# Altium schematic sheet POWER_TESTER_V2.SchDoc
size 660 x 513 mm
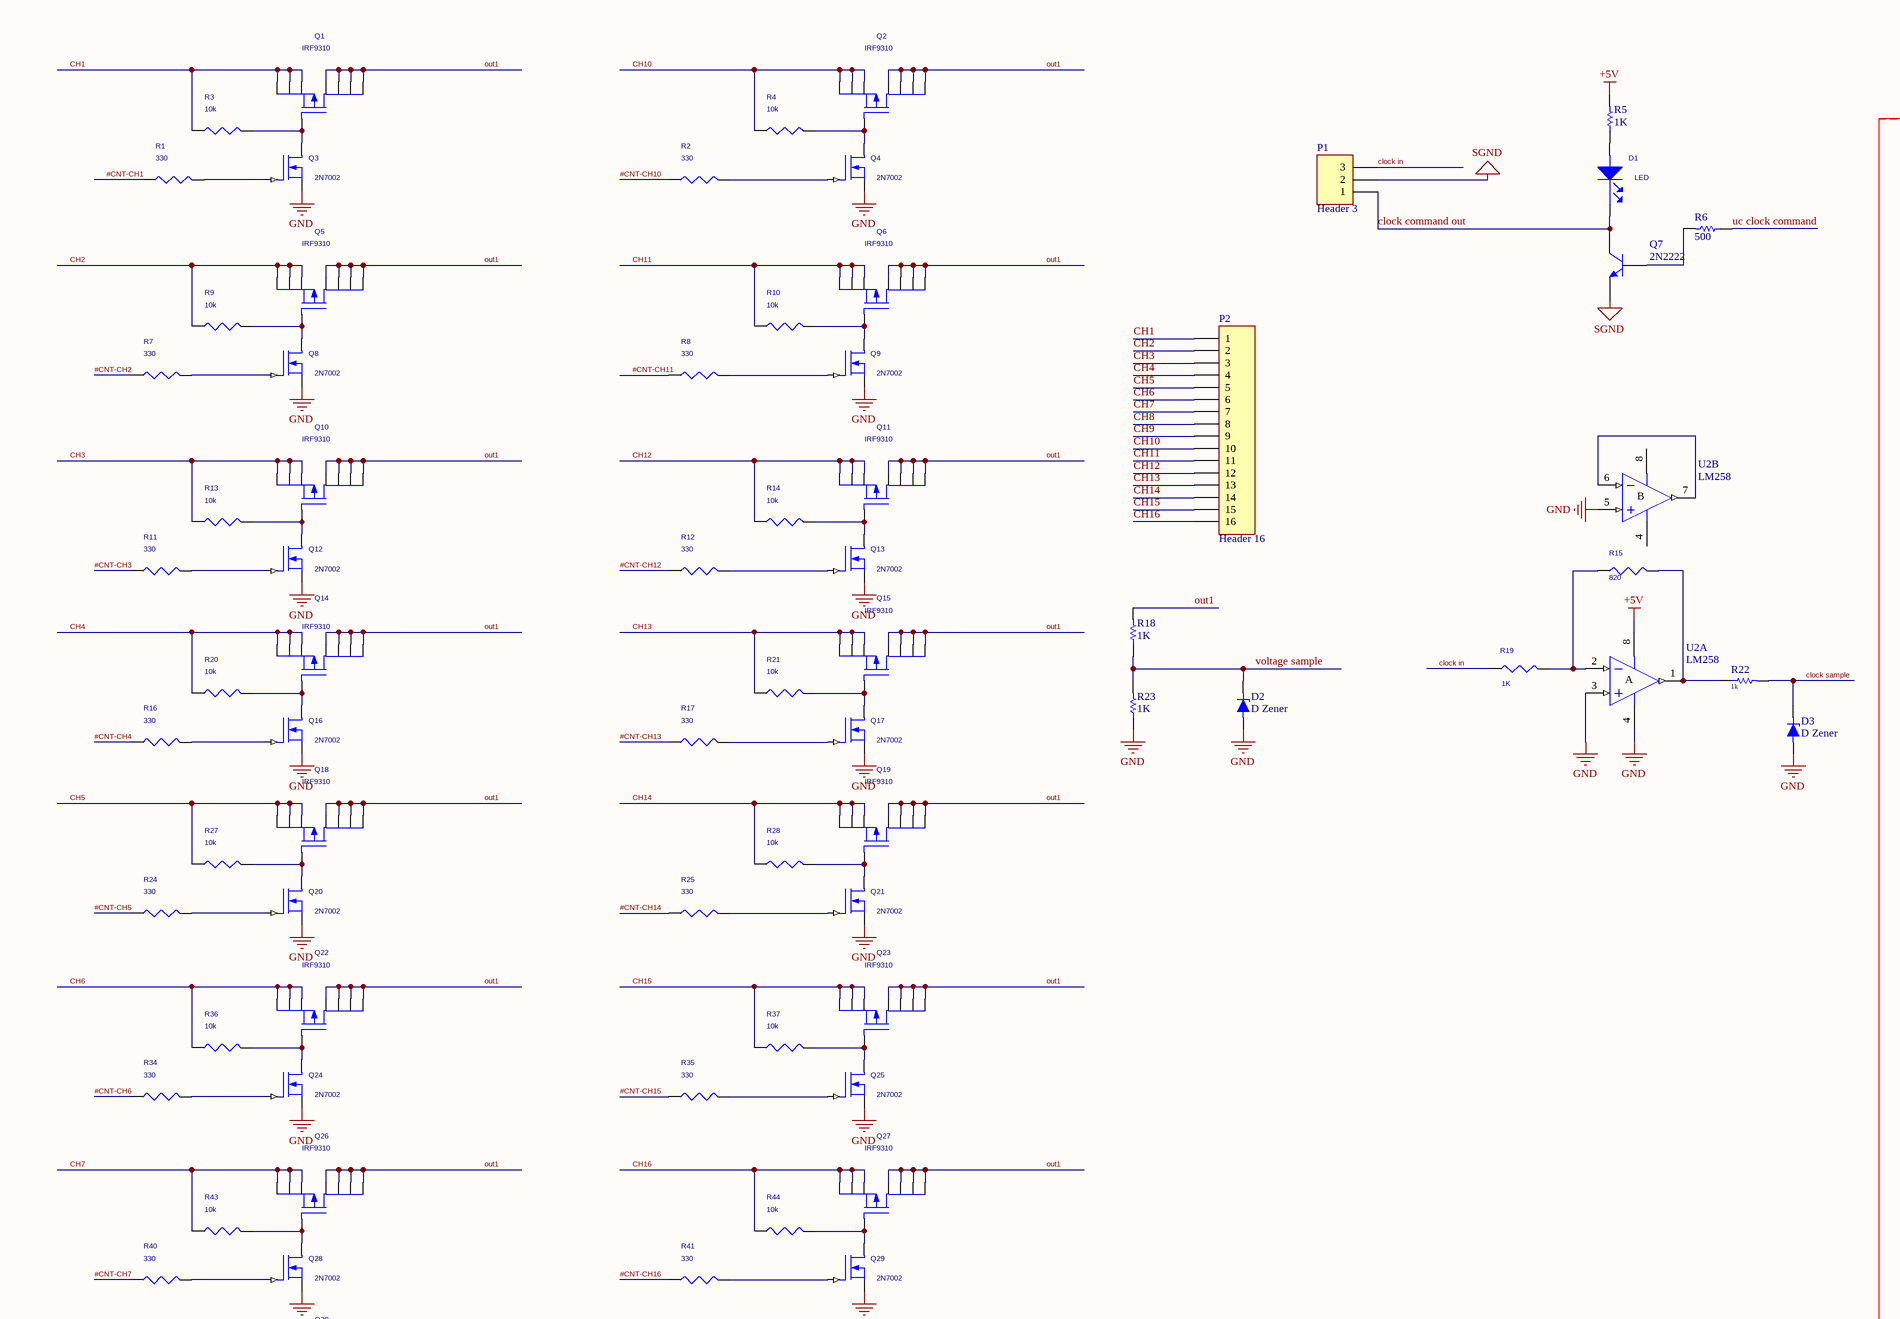
[diagram p0: POWER_TESTER_V2.SchDoc, top left]
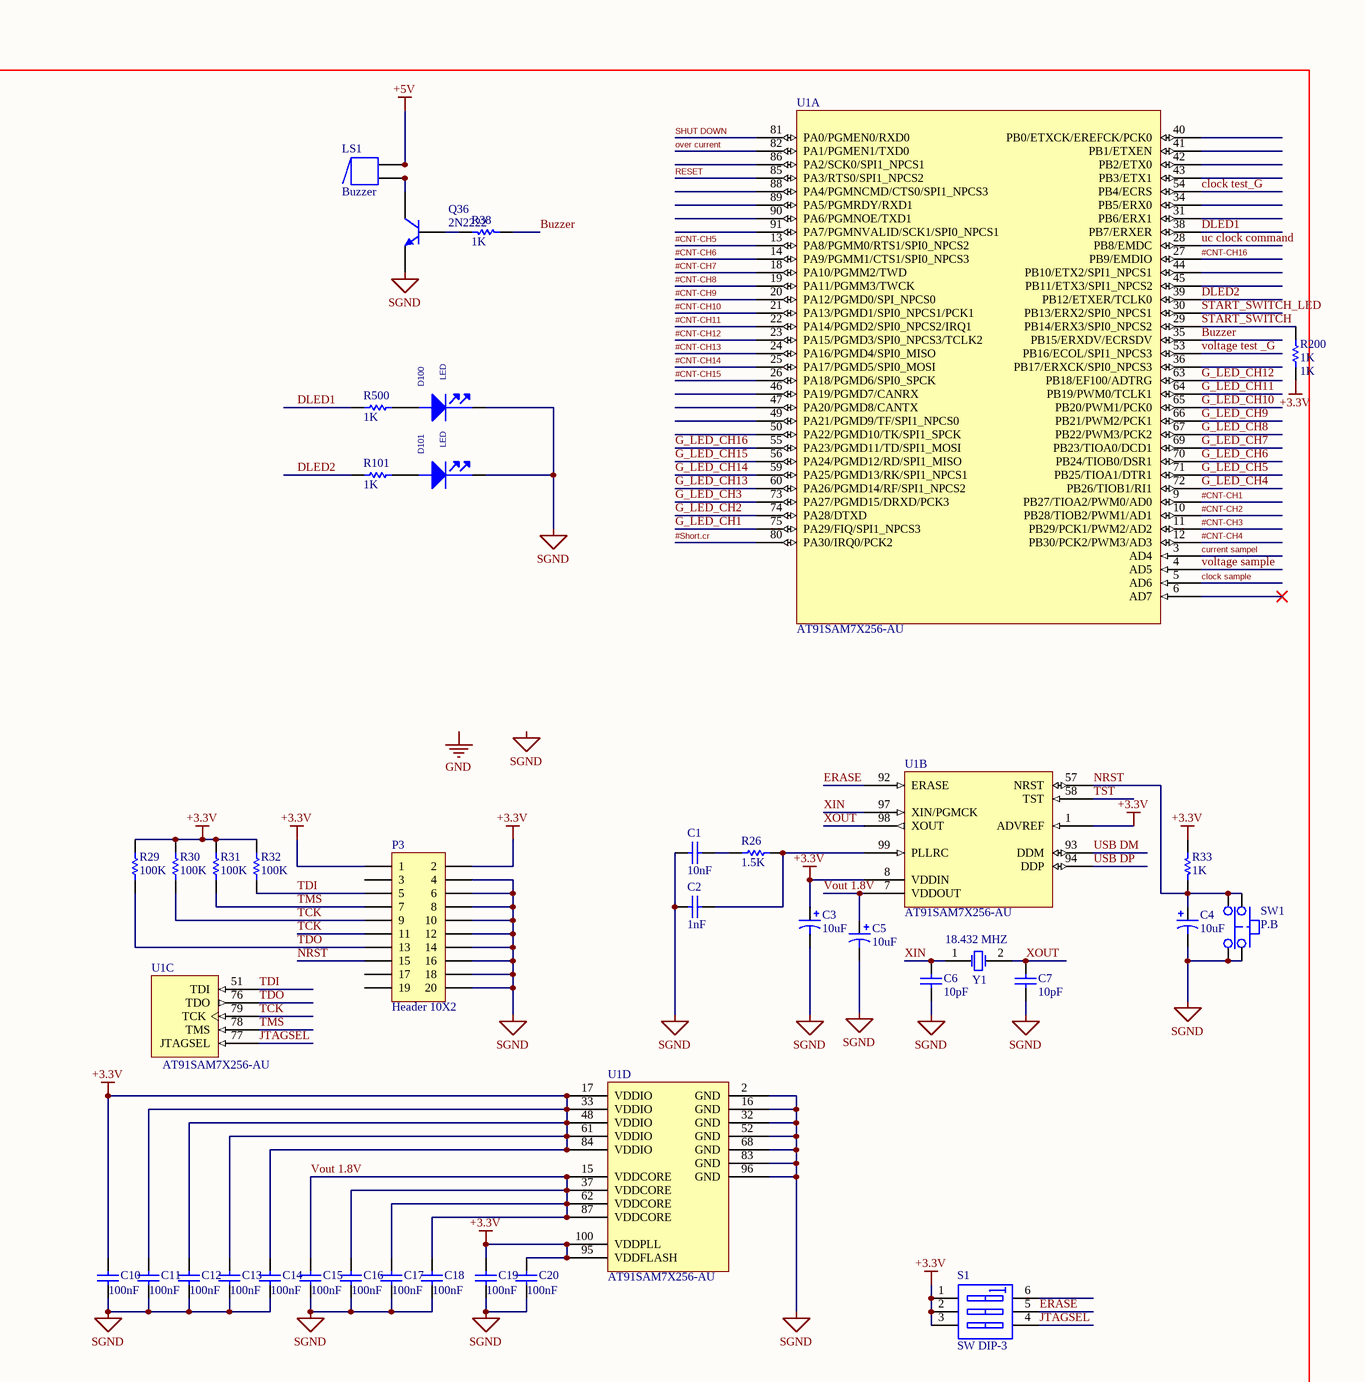
[diagram p1: POWER_TESTER_V2.SchDoc, top right]
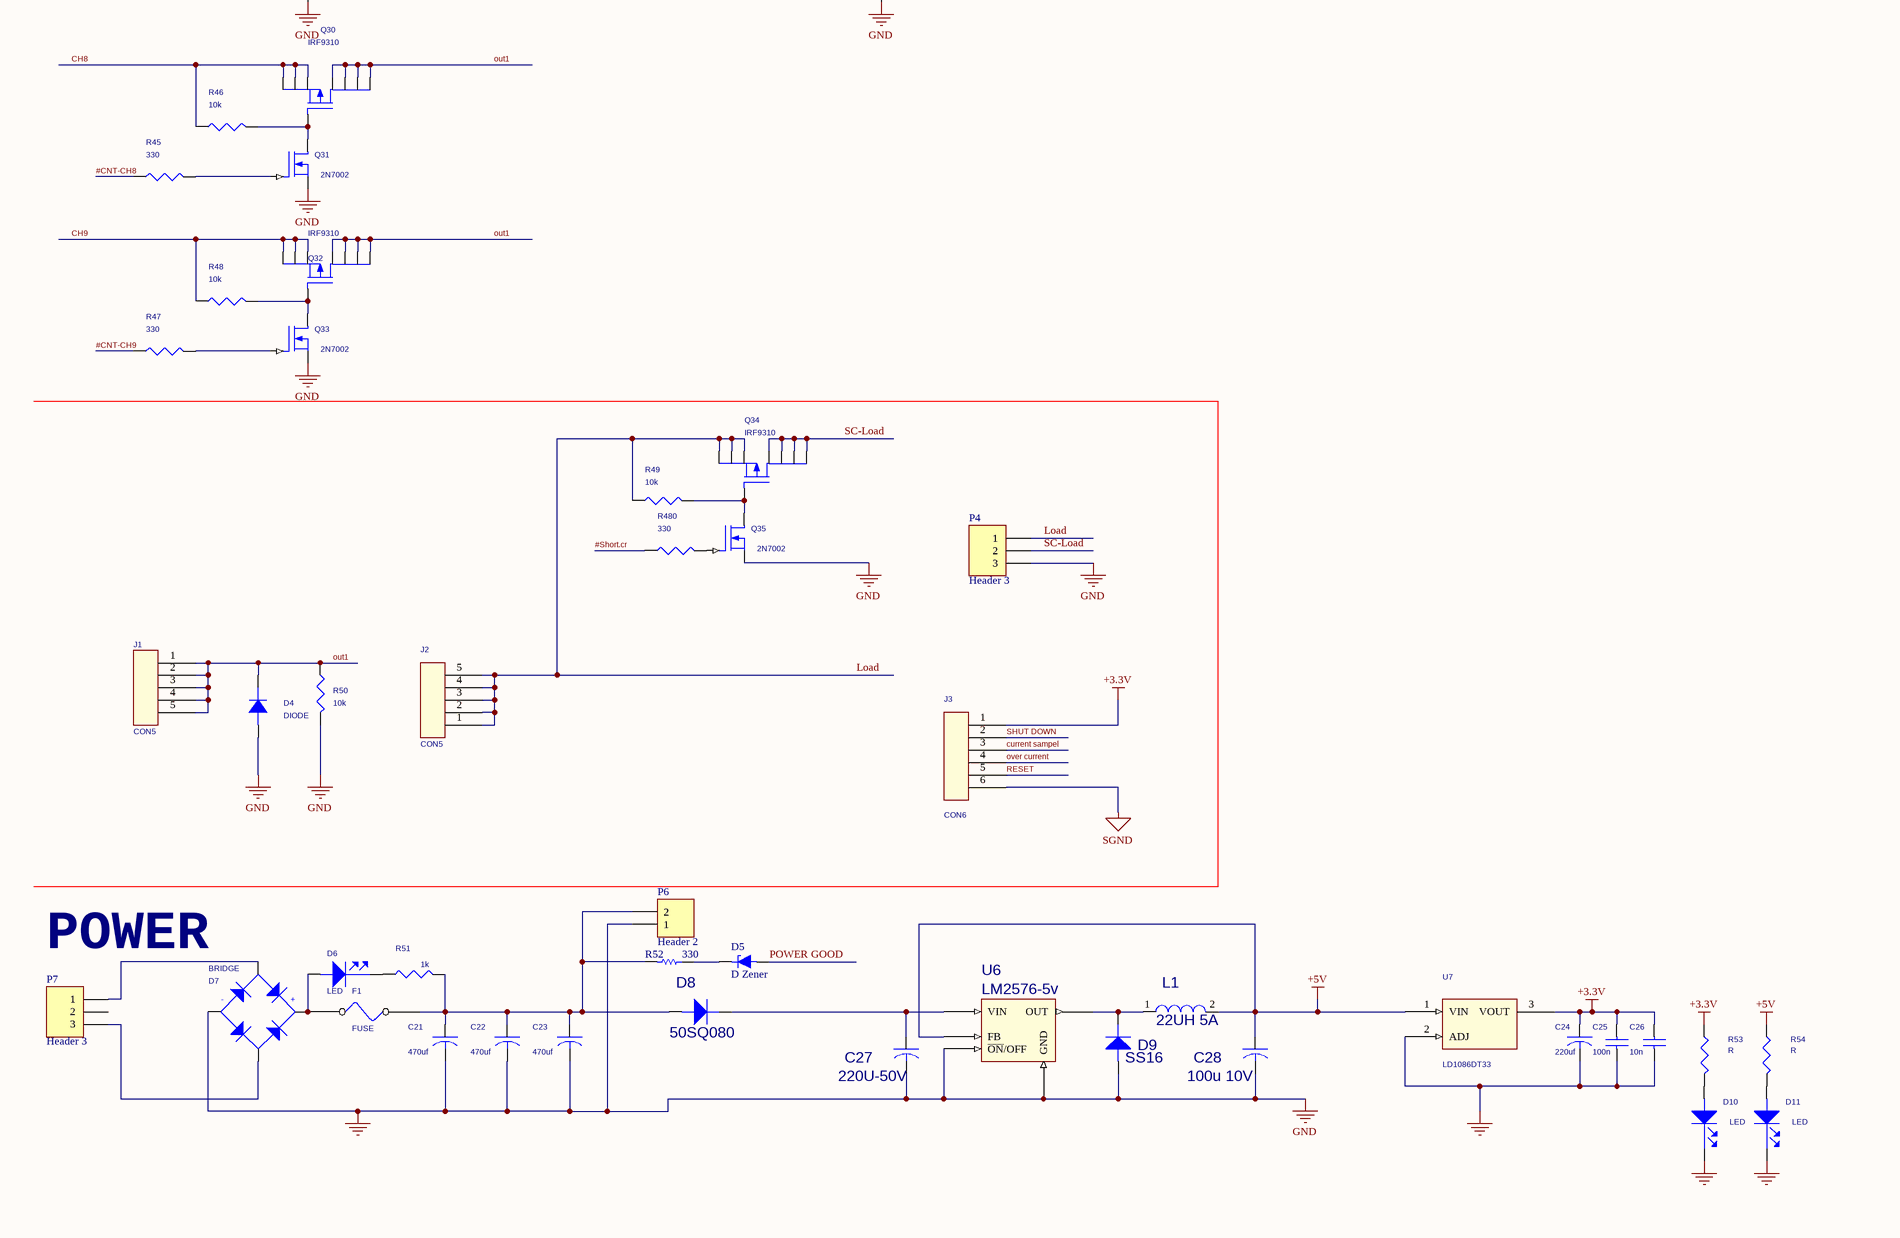
[diagram p2: POWER_TESTER_V2.SchDoc, bottom left]
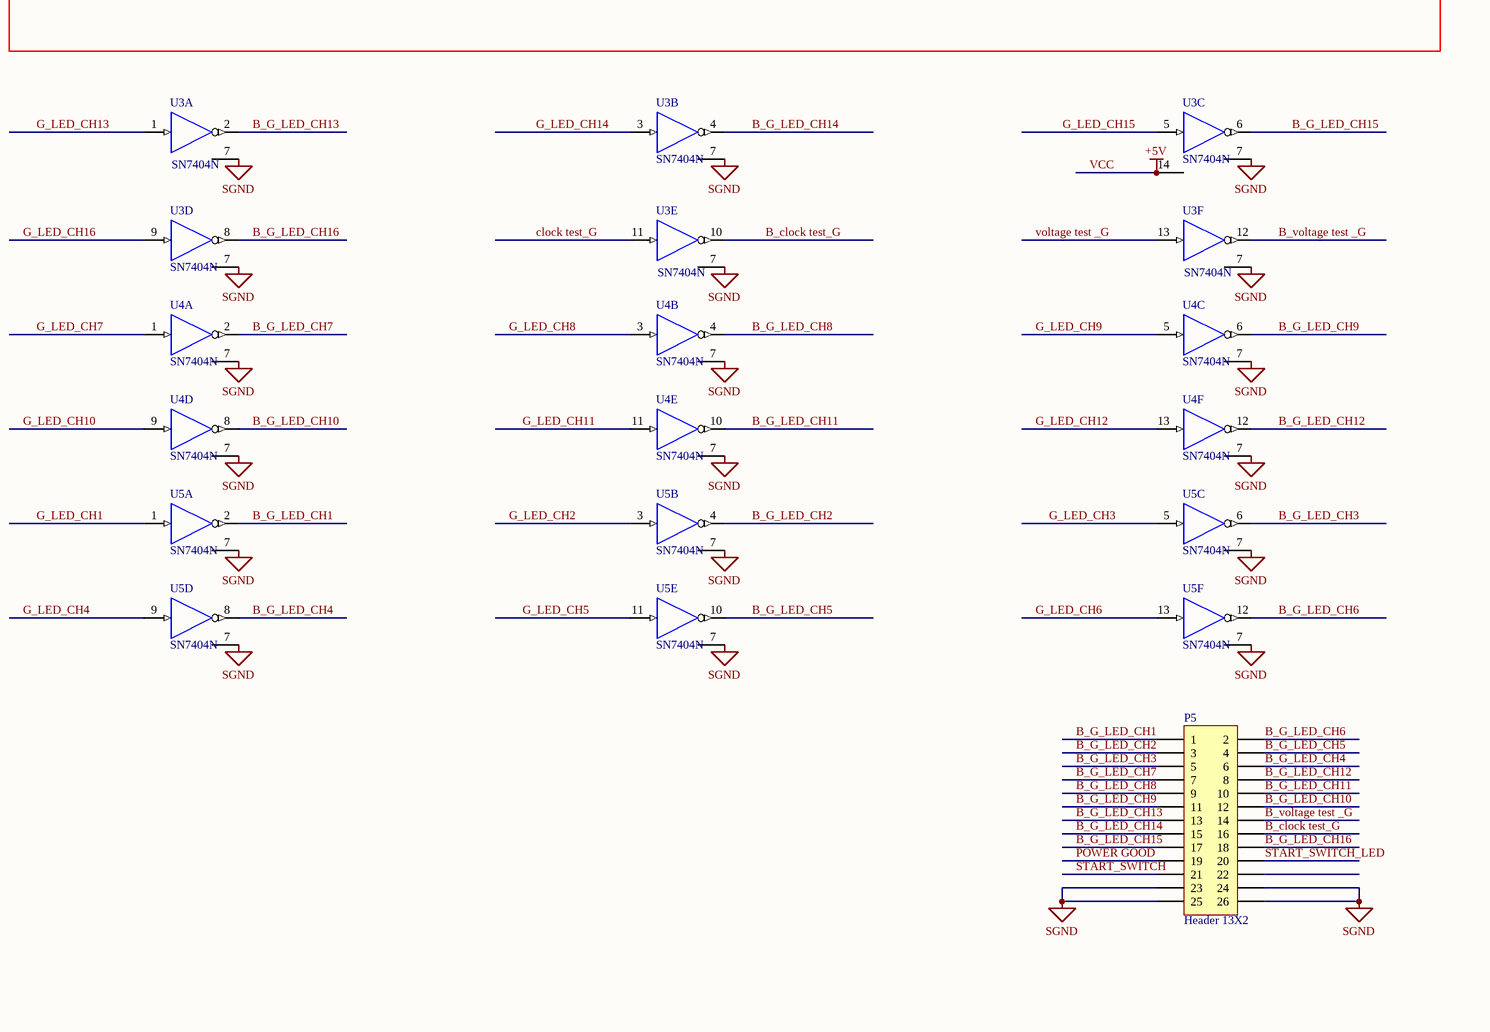
[diagram p3: POWER_TESTER_V2.SchDoc, bottom right]

## Parts
C1  10nF  [0603BIG]
C2  1nF  [0603BIG]
C3  10uF  [0603BIG]
C4  10uF  [0603BIG]
C5  10uF  [0603BIG]
C6  10pF  [0603BIG]
C7  10pF  [0603BIG]
C10  100nF  [0603BIG]
C11  100nF  [0603BIG]
C12  100nF  [0603BIG]
C13  100nF  [0603BIG]
C14  100nF  [0603BIG]
C15  100nF  [0603BIG]
C16  100nF  [0603BIG]
C17  100nF  [0603BIG]
C18  100nF  [0603BIG]
C19  100nF  [0603BIG]
C20  100nF  [0603BIG]
C21  470uf  [CAP-SMD-HV2]
C22  470uf  [CAP-SMD-HV2]
C23  470uf  [CAP-SMD-HV2]
C24  220uf  [1210-C]
C25  100n  [0603big]
C26  10n  [0603big]
C27  220U-50V  [CAP-SMD-HV2]
C28  100u 10V  [CAP_TANTAL_B]
D1  LED  [0805-d1]
D2  D Zener  [8-1206]
D3  D Zener  [8-1206]
D4  DIODE  [ss14]
D5  D Zener  [8-1206]
D6  LED  [0805-2D]
D7  BRIDGE  [BRG5A]
D8  50SQ080  [SS14]
D9  SS16  [SS14]
D10  LED  [0805-D1]
D11  LED  [0805-d1]
D100  LED  [0805-d1]
D101  LED  [0805-d1]
F1  FUSE  [8-1206]
J1  CON5  [SIP5]
J2  CON5  [SIP5]
J3  CON6  [SIP6]
L1  22UH 5A  [self smd]
LS1  Buzzer  [Buzzer]
P1  Header 3  [mokhaberati3PIN]
P2  Header 16  [wire_connector]
P3  Header 10X2  [IDC20]
P4  Header 3  [PHONIX 3]
P5  Header 13X2  [918526x904]
P6  Header 2  [mokhaberati]
P7  Header 3  [SIP3-155-la]
Q1  IRF9310  [so-8]
Q2  IRF9310  [so-8]
Q3  2N7002  [SOT-23]
Q4  2N7002  [SOT-23]
Q5  IRF9310  [so-8]
Q6  IRF9310  [so-8]
Q7  2N2222  [SOT23_M]
Q8  2N7002  [SOT-23]
Q9  2N7002  [SOT-23]
Q10  IRF9310  [so-8]
Q11  IRF9310  [so-8]
Q12  2N7002  [SOT-23]
Q13  2N7002  [SOT-23]
Q14  IRF9310  [so-8]
Q15  IRF9310  [so-8]
Q16  2N7002  [SOT-23]
Q17  2N7002  [SOT-23]
Q18  IRF9310  [so-8]
Q19  IRF9310  [so-8]
Q20  2N7002  [SOT-23]
Q21  2N7002  [SOT-23]
Q22  IRF9310  [so-8]
Q23  IRF9310  [so-8]
Q24  2N7002  [SOT-23]
Q25  2N7002  [SOT-23]
Q26  IRF9310  [so-8]
Q27  IRF9310  [so-8]
Q28  2N7002  [SOT-23]
Q29  2N7002  [SOT-23]
Q30  IRF9310  [so-8]
Q31  2N7002  [SOT-23]
Q32  IRF9310  [so-8]
Q33  2N7002  [SOT-23]
Q34  IRF9310  [so-8]
Q35  2N7002  [SOT-23]
Q36  2N2222  [SOT23_M]
R1  330  [0603BIG]
R2  330  [0603BIG]
R3  10k  [0603BIG]
R4  10k  [0603BIG]
R5  1K  [0603BIG]
R6  500  [0603BIG]
R7  330  [0603BIG]
R8  330  [0603BIG]
R9  10k  [0603BIG]
R10  10k  [0603BIG]
R11  330  [0603BIG]
R12  330  [0603BIG]
R13  10k  [0603BIG]
R14  10k  [0603BIG]
R15  820  [0603BIG]
R16  330  [0603BIG]
R17  330  [0603BIG]
R18  1K  [0603BIG]
R19  1K  [0603BIG]
R20  10k  [0603BIG]
R21  10k  [0603BIG]
R22  1k  [0603big]
R23  1K  [0603BIG]
R24  330  [0603BIG]
R25  330  [0603BIG]
R26  1.5K  [0603BIG]
R27  10k  [0603BIG]
R28  10k  [0603BIG]
R29  100K  [0603BIG]
R30  100K  [0603BIG]
R31  100K  [0603BIG]
R32  100K  [0603BIG]
R33  1K  [0603BIG]
R34  330  [0603BIG]
R35  330  [0603BIG]
R36  10k  [0603BIG]
R37  10k  [0603BIG]
R38  1K  [0603BIG]
R40  330  [0603BIG]
R41  330  [0603BIG]
R43  10k  [0603BIG]
R44  10k  [0603BIG]
R45  330  [0603BIG]
R46  10k  [0603BIG]
R47  330  [0603BIG]
R48  10k  [0603BIG]
R49  10k  [0603BIG]
R50  10k  [0603BIG]
R51  1k  [0603BIG]
R52  330  [0603BIG]
R53  R  [0603big]
R54  R  [0603big]
R101  1K  [0603BIG]
R200  1K  [0603BIG]
R480  330  [0603BIG]
R500  1K  [0603BIG]
S1  SW DIP-3  [DIP-6]
SW1  P.B  [SW_200]
U1  AT91SAM7X256-AU  [LQFP100]  (parts A,B,C,D of 4)
U2  LM258  [so-8]  (parts A,B of 2)
U3  SN7404N  [D014_N]  (parts A,B,C,D,E,F of 6)
U4  SN7404N  [D014_N]  (parts A,B,C,D,E,F of 6)
U5  SN7404N  [D014_N]  (parts A,B,C,D,E,F of 6)
U6  LM2576-5v  [LM2576-SMD]
U7  LD1086DT33  [7805_SMD]
Y1  18.432 MHZ  [NIRAXTAL-smd]

## Nets
+3.3V: C3.1 C10.2 C11.2 C12.2 C13.2 C14.2 C19.2 C20.2 C24.1 C25.1 C26.1 J3.1 P3.1 P3.2 R29.2 R30.2 R31.2 R32.2 R33.2 R53.1 R200.1 S1.1(A1) S1.2(A2) S1.3(A3) U1.1(ADVREF) U1.8(VDDIN) U1.17(VDDIO) U1.33(VDDIO) U1.48(VDDIO) U1.61(VDDIO) U1.84(VDDIO) U1.95(VDDFLASH) U1.100(VDDPLL) U7.3(VOUT)
GND: C21.2 C22.2 C23.2 C24.2 C25.2 C26.2 C27.2 C28.2 D2.1(A) D3.1(A) D4.A D7.DC- D9.A D10.K D11.K P4.3 P6.1 Q3.3(SOURCE) Q4.3(SOURCE) Q8.3(SOURCE) Q9.3(SOURCE) Q12.3(SOURCE) Q13.3(SOURCE) Q16.3(SOURCE) Q17.3(SOURCE) Q20.3(SOURCE) Q21.3(SOURCE) Q24.3(SOURCE) Q25.3(SOURCE) Q28.3(SOURCE) Q29.3(SOURCE) Q31.3(SOURCE) Q33.3(SOURCE) Q35.3(SOURCE) R23.1 R50.2 U2.3(IN+) U2.4(V-) U2.5(IN+) U6.GND U6.O\N\/OFF(~{ON}/OFF) U7.2(ADJ)
SGND: C1.1 C2.1 C3.2 C4.2 C5.2 C6.1 C7.1 C10.1 C11.1 C12.1 C13.1 C14.1 C15.1 C16.1 C17.1 C18.1 C19.1 C20.1 D100.K D101.K J3.6 P1.2 P3.4 P3.6 P3.8 P3.10 P3.12 P3.14 P3.16 P3.18 P3.20 P5.23 P5.24 P5.25 P5.26 Q7.1(E) Q36.1(E) SW1.1 U1.2(GND) U1.16(GND) U1.32(GND) U1.52(GND) U1.68(GND) U1.83(GND) U1.96(GND) U3.7(GND) U4.7(SGND) U5.7(GND)
VCC: C28.1 L1.2 LS1.1A R5.2 R54.1 U2.8(V+) U3.14(VCC) U4.14(VCC) U5.14(VCC) U6.FB U7.1(VIN)  [also labelled +5V]
#CNT-CH1: R1.1 U1.9(PB27/TIOA2/PWM0/AD0)
#CNT-CH2: R7.1 U1.10(PB28/TIOB2/PWM1/AD1)
#CNT-CH3: R11.1 U1.11(PB29/PCK1/PWM2/AD2)
#CNT-CH4: R16.1 U1.12(PB30/PCK2/PWM3/AD3)
#CNT-CH5: R24.1 U1.13(PA8/PGMM0/RTS1/SPI0_NPCS2)
#CNT-CH6: R34.1 U1.14(PA9/PGMM1/CTS1/SPI0_NPCS3)
#CNT-CH7: R40.1 U1.18(PA10/PGMM2/TWD)
#CNT-CH8: R45.1 U1.19(PA11/PGMM3/TWCK)
#CNT-CH9: R47.1 U1.20(PA12/PGMD0/SPI_NPCS0)
#CNT-CH10: R2.1 U1.21(PA13/PGMD1/SPI0_NPCS1/PCK1)
#CNT-CH11: R8.1 U1.22(PA14/PGMD2/SPI0_NPCS2/IRQ1)
#CNT-CH12: R12.1 U1.23(PA15/PGMD3/SPI0_NPCS3/TCLK2)
#CNT-CH13: R17.1 U1.24(PA16/PGMD4/SPI0_MISO)
#CNT-CH14: R25.1 U1.25(PA17/PGMD5/SPI0_MOSI)
#CNT-CH15: R35.1 U1.26(PA18/PGMD6/SPI0_SPCK)
#CNT-CH16: R41.1 U1.27(PB9/EMDIO)
#Short.cr: R480.1 U1.80(PA30/IRQ0/PCK2)
B_clock test_G: P5.16 U3.10(Y)
B_G_LED_CH1: P5.1 U5.2(Y)
B_G_LED_CH2: P5.3 U5.4(Y)
B_G_LED_CH3: P5.5 U5.6(Y)
B_G_LED_CH4: P5.6 U5.8(Y)
B_G_LED_CH5: P5.4 U5.10(Y)
B_G_LED_CH6: P5.2 U5.12(Y)
B_G_LED_CH7: P5.7 U4.2(Y)
B_G_LED_CH8: P5.9 U4.4(Y)
B_G_LED_CH9: P5.11 U4.6(Y)
B_G_LED_CH10: P5.12 U4.8(Y)
B_G_LED_CH11: P5.10 U4.10(Y)
B_G_LED_CH12: P5.8 U4.12(Y)
B_G_LED_CH13: P5.13 U3.2(Y)
B_G_LED_CH14: P5.15 U3.4(Y)
B_G_LED_CH15: P5.17 U3.6(Y)
B_G_LED_CH16: P5.18 U3.8(Y)
B_voltage test _G: P5.14 U3.12(Y)
Buzzer: R38.1 U1.35(PB15/ERXDV/ECRSDV)
CH1: P2.1 Q1.1(S1) Q1.2(S2) Q1.3(S3) R3.1
CH2: P2.2 Q5.1(S1) Q5.2(S2) Q5.3(S3) R9.1
CH3: P2.3 Q10.1(S1) Q10.2(S2) Q10.3(S3) R13.1
CH4: P2.4 Q14.1(S1) Q14.2(S2) Q14.3(S3) R20.1
CH5: P2.5 Q18.1(S1) Q18.2(S2) Q18.3(S3) R27.1
CH6: P2.6 Q22.1(S1) Q22.2(S2) Q22.3(S3) R36.1
CH7: P2.7 Q26.1(S1) Q26.2(S2) Q26.3(S3) R43.1
CH8: P2.8 Q30.1(S1) Q30.2(S2) Q30.3(S3) R46.1
CH9: P2.9 Q32.1(S1) Q32.2(S2) Q32.3(S3) R48.1
CH10: P2.10 Q2.1(S1) Q2.2(S2) Q2.3(S3) R4.1
CH11: P2.11 Q6.1(S1) Q6.2(S2) Q6.3(S3) R10.1
CH12: P2.12 Q11.1(S1) Q11.2(S2) Q11.3(S3) R14.1
CH13: P2.13 Q15.1(S1) Q15.2(S2) Q15.3(S3) R21.1
CH14: P2.14 Q19.1(S1) Q19.2(S2) Q19.3(S3) R28.1
CH15: P2.15 Q23.1(S1) Q23.2(S2) Q23.3(S3) R37.1
CH16: P2.16 Q27.1(S1) Q27.2(S2) Q27.3(S3) R44.1
clock command out: D1.K P1.1 Q7.3(C)
clock in: P1.3 R19.1
clock sample: D3.2(K) R22.2 U1.5(AD6)
clock test_G: U1.54(PB4/ECRS) U3.11(A)
current sampel: J3.3 U1.3(AD4)
DLED1: R500.2 U1.38(PB7/ERXER)
DLED2: R101.2 U1.39(PB12/ETXER/TCLK0)
ERASE: S1.5(B2) U1.92(ERASE)
G_LED_CH1: U1.75(PA29/FIQ/SPI1_NPCS3) U5.1(A)
G_LED_CH2: U1.74(PA28/DTXD) U5.3(A)
G_LED_CH3: U1.73(PA27/PGMD15/DRXD/PCK3) U5.5(A)
G_LED_CH4: U1.72(PB26/TIOB1/RI1) U5.9(A)
G_LED_CH5: U1.71(PB25/TIOA1/DTR1) U5.11(A)
G_LED_CH6: U1.70(PB24/TIOB0/DSR1) U5.13(A)
G_LED_CH7: U1.69(PB23/TIOA0/DCD1) U4.1(A)
G_LED_CH8: U1.67(PB22/PWM3/PCK2) U4.3(A)
G_LED_CH9: U1.66(PB21/PWM2/PCK1) U4.5(A)
G_LED_CH10: U1.65(PB20/PWM1/PCK0) U4.9(A)
G_LED_CH11: U1.64(PB19/PWM0/TCLK1) U4.11(A)
G_LED_CH12: U1.63(PB18/EF100/ADTRG) U4.13(A)
G_LED_CH13: U1.60(PA26/PGMD14/RF/SPI1_NPCS2) U3.1(A)
G_LED_CH14: U1.59(PA25/PGMD13/RK/SPI1_NPCS1) U3.3(A)
G_LED_CH15: U1.56(PA24/PGMD12/RD/SPI1_MISO) U3.5(A)
G_LED_CH16: U1.55(PA23/PGMD11/TD/SPI1_MOSI) U3.9(A)
JTAGSEL: S1.4(B3) U1.77(JTAGSEL)
Load: J2.1 J2.2 J2.3 J2.4 J2.5 P4.1 Q34.1(S1) Q34.2(S2) Q34.3(S3) R49.1
NRST: C4.1 P3.15 R33.1 SW1.2 U1.57(NRST)
out1: D4.K J1.1 J1.2 J1.3 J1.4 J1.5 Q1.5(D1) Q1.6(D2) Q1.7(D3) Q1.8(D4) Q2.5(D1) Q2.6(D2) Q2.7(D3) Q2.8(D4) Q5.5(D1) Q5.6(D2) Q5.7(D3) Q5.8(D4) Q6.5(D1) Q6.6(D2) Q6.7(D3) Q6.8(D4) Q10.5(D1) Q10.6(D2) Q10.7(D3) Q10.8(D4) Q11.5(D1) Q11.6(D2) Q11.7(D3) Q11.8(D4) Q14.5(D1) Q14.6(D2) Q14.7(D3) Q14.8(D4) Q15.5(D1) Q15.6(D2) Q15.7(D3) Q15.8(D4) Q18.5(D1) Q18.6(D2) Q18.7(D3) Q18.8(D4) Q19.5(D1) Q19.6(D2) Q19.7(D3) Q19.8(D4) Q22.5(D1) Q22.6(D2) Q22.7(D3) Q22.8(D4) Q23.5(D1) Q23.6(D2) Q23.7(D3) Q23.8(D4) Q26.5(D1) Q26.6(D2) Q26.7(D3) Q26.8(D4) Q27.5(D1) Q27.6(D2) Q27.7(D3) Q27.8(D4) Q30.5(D1) Q30.6(D2) Q30.7(D3) Q30.8(D4) Q32.5(D1) Q32.6(D2) Q32.7(D3) Q32.8(D4) R18.2 R50.1
over current: J3.4 U1.82(PA1/PGMEN1/TXD0)
POWER GOOD: D5.1(A) P5.19
RESET: J3.5 U1.85(PA3/RTS0/SPI1_NPCS2)
SC-Load: P4.2 Q34.5(D1) Q34.6(D2) Q34.7(D3) Q34.8(D4)
SHUT DOWN: J3.2 U1.81(PA0/PGMEN0/RXD0)
START_SWITCH: P5.21 R200.2 U1.29(PB14/ERX3/SPI0_NPCS2)
START_SWITCH_LED: P5.20 U1.30(PB13/ERX2/SPI0_NPCS1)
TCK: P3.9 P3.11 R30.1 U1.79(TCK)
TDI: P3.5 R32.1 U1.51(TDI)
TDO: P3.13 R29.1 U1.76(TDO)
TMS: P3.7 R31.1 U1.78(TMS)
TST: U1.58(TST)
uc clock command: R6.1 U1.28(PB8/EMDC)
USB DM: U1.93(DDM)
USB DP: U1.94(DDP)
voltage sample: D2.2(K) R18.1 R23.2 U1.4(AD5)
voltage test _G: U1.53(PB16/ECOL/SPI1_NPCS3) U3.13(A)
Vout 1.8V: C5.1 C15.2 C16.2 C17.2 C18.2 U1.7(VDDOUT) U1.15(VDDCORE) U1.37(VDDCORE) U1.62(VDDCORE) U1.87(VDDCORE)
XIN: C6.2 U1.97(XIN/PGMCK) Y1.1(OSC1)
XOUT: C7.2 U1.98(XOUT) Y1.2(OSC2)
NetC1_2: C1.2 R26.1
NetC2_2: C2.2 R26.2 U1.99(PLLRC)
NetC21_1: C21.1 C22.1 C23.1 D8.A F1.2 P6.2 R51.2 R52.2
NetC27_1: C27.1 D8.K U6.VIN
NetD1_A: D1.A R5.1
NetD5_2: D5.2(K) R52.1
NetD6_A: D6.A D7.DC+ F1.1
NetD6_K: D6.K R51.1
NetD7_AC1: D7.AC1 P7.1
NetD7_AC2: D7.AC2 P7.3
NetD9_K: D9.K L1.1 U6.OUT
NetD10_A: D10.A R53.2
NetD11_A: D11.A R54.2
NetD100_A: D100.A R500.1
NetD101_A: D101.A R101.1
NetLS1_2A: LS1.2A Q36.3(C)
NetQ1_4: Q1.4(G) Q3.2(DRAIN) R3.2
NetQ2_4: Q2.4(G) Q4.2(DRAIN) R4.2
NetQ3_1: Q3.1(GATE) R1.2
NetQ4_1: Q4.1(GATE) R2.2
NetQ5_4: Q5.4(G) Q8.2(DRAIN) R9.2
NetQ6_4: Q6.4(G) Q9.2(DRAIN) R10.2
NetQ7_2: Q7.2(B) R6.2
NetQ8_1: Q8.1(GATE) R7.2
NetQ9_1: Q9.1(GATE) R8.2
NetQ10_4: Q10.4(G) Q12.2(DRAIN) R13.2
NetQ11_4: Q11.4(G) Q13.2(DRAIN) R14.2
NetQ12_1: Q12.1(GATE) R11.2
NetQ13_1: Q13.1(GATE) R12.2
NetQ14_4: Q14.4(G) Q16.2(DRAIN) R20.2
NetQ15_4: Q15.4(G) Q17.2(DRAIN) R21.2
NetQ16_1: Q16.1(GATE) R16.2
NetQ17_1: Q17.1(GATE) R17.2
NetQ18_4: Q18.4(G) Q20.2(DRAIN) R27.2
NetQ19_4: Q19.4(G) Q21.2(DRAIN) R28.2
NetQ20_1: Q20.1(GATE) R24.2
NetQ21_1: Q21.1(GATE) R25.2
NetQ22_4: Q22.4(G) Q24.2(DRAIN) R36.2
NetQ23_4: Q23.4(G) Q25.2(DRAIN) R37.2
NetQ24_1: Q24.1(GATE) R34.2
NetQ25_1: Q25.1(GATE) R35.2
NetQ26_4: Q26.4(G) Q28.2(DRAIN) R43.2
NetQ27_4: Q27.4(G) Q29.2(DRAIN) R44.2
NetQ28_1: Q28.1(GATE) R40.2
NetQ29_1: Q29.1(GATE) R41.2
NetQ30_4: Q30.4(G) Q31.2(DRAIN) R46.2
NetQ31_1: Q31.1(GATE) R45.2
NetQ32_4: Q32.4(G) Q33.2(DRAIN) R48.2
NetQ33_1: Q33.1(GATE) R47.2
NetQ34_4: Q34.4(G) Q35.2(DRAIN) R49.2
NetQ35_1: Q35.1(GATE) R480.2
NetQ36_2: Q36.2(B) R38.2
NetR15_1: R15.1 R19.2 U2.2(IN-)
NetR15_2: R15.2 R22.1 U2.1(OUT)
NetU2_6: U2.6(IN-) U2.7(OUT)

Not connected (* = marked no-connect by the designer): P3 3 17 19; P5 22; P7 2; S1 6(B1); U1 6(AD7)* 31(PB6/ERX1) 34(PB5/ERX0) 36(PB17/ERXCK/SPI0_NPCS3) 40(PB0/ETXCK/EREFCK/PCK0) 41(PB1/ETXEN) 42(PB2/ETX0) 43(PB3/ETX1) 44(PB10/ETX2/SPI1_NPCS1) 45(PB11/ETX3/SPI1_NPCS2) 46(PA19/PGMD7/CANRX) 47(PA20/PGMD8/CANTX) 49(PA21/PGMD9/TF/SPI1_NPCS0) 50(PA22/PGMD10/TK/SPI1_SPCK) 86(PA2/SCK0/SPI1_NPCS1) 88(PA4/PGMNCMD/CTS0/SPI1_NPCS3) 89(PA5/PGMRDY/RXD1) 90(PA6/PGMNOE/TXD1) 91(PA7/PGMNVALID/SCK1/SPI0_NPCS1)

## Notes on the sheet
- POWER
- Labels drawn without touching a wire or pin: GND, SGND
- (in symbol BRIDGE) -; +
- (in symbol OP279GS, part A) A
- (in symbol OP279GS, part B) B

## Library data of the parts
C1 C2 C6 C7 C10-C20 = Cap: Capacitor; Published: 8-Jun-2000; LatestRevisionDate: 17-Jul-2002; LatestRevisionNote: Re-released for DXP Platform.; PackageReference: RAD-0.3; Publisher: Altium Limited; PackageDescription: Radial Cap, Thru-Hole; 2 Leads; 0.3 in Pin Spacing
  C1: Value: 10nF
  C2: Value: 1nF
  C6 C7: Value: 10pF
  C10-C20: Value: 100nF
C3 C5 = Cap Pol1: 10v; Published: 8-Jun-2000; LatestRevisionDate: 17-Jul-2002; LatestRevisionNote: Re-released for DXP Platform.; PackageReference: RB7.6-15; Publisher: Altium Limited; PackageDescription: Polarized Capacitor (Radial); 2 Leads; Value: 10uF
C4 = Cap Pol1: Polarized Capacitor (Radial); Published: 8-Jun-2000; LatestRevisionDate: 17-Jul-2002; LatestRevisionNote: Re-released for DXP Platform.; PackageReference: RB7.6-15; Publisher: Altium Limited; PackageDescription: Polarized Capacitor (Radial); 2 Leads; Value: 10uF
C21-C24 = CAP_Dup1
C25 C26 = C
C27 C28 = CAP
D2 D3 D5 = D Zener: Zener Diode; Published: 8-Jun-2000; LatestRevisionDate: 17-Jul-2002; LatestRevisionNote: Re-released for DXP Platform.; PackageReference: DIODE-0.7; Publisher: Altium Limited
D4 = DIODE_0
D8 D9 = DIODE
L1 = L: PSpiceTemplate: L^@REFDES %1 %2 ?TOLERANCE|L^@REFDES| @VALUE ?IC/IC=@IC/ ?TOLERANCE|\n.model l^@REFDES IND L=1 DEV=@TOLERANCE%|
LS1 = Buzzer: Magnetic Transducer Buzzer; Published: 24-Mar-1999; LatestRevisionDate: 17-Dec-2003; LatestRevisionNote: Schematic revised, PCB Footprint replaced.; DatasheetVersion: 17-Dec-2003; PackageReference: ABSM-1574; Publisher: Altium Limited; PackageDescription: Magnetic Transducer Buzzer; ComponentLink1Description: Manufacturer Link; ComponentLink1URL: http://www.megastar.com/linecard/buzzmode/index.php
P1 P4 P7 = Header 3: Header, 3-Pin; LatestRevisionDate: 17-Jul-2002; LatestRevisionNote: Re-released for DXP Platform.; Publisher: Altium Limited
P2 = Header 16: Header, 16-Pin; LatestRevisionDate: 17-Jul-2002; LatestRevisionNote: Re-released for DXP Platform.; Publisher: Altium Limited
P3 = Header 10X2: Header, 10-Pin, Dual row; LatestRevisionDate: 17-Jul-2002; LatestRevisionNote: Re-released for DXP Platform.; Publisher: Altium Limited
P5 = Header 13X2: Header, 13-Pin, Dual row; LatestRevisionDate: 17-Jul-2002; LatestRevisionNote: Re-released for DXP Platform.; Publisher: Altium Limited
P6 = Header 2: Header, 2-Pin; LatestRevisionDate: 17-Jul-2002; LatestRevisionNote: Re-released for DXP Platform.; Publisher: Altium Limited
Q1 Q2 Q5 Q6 Q10 Q11 Q14 Q15 Q18 Q19 Q22 Q23 Q26 Q27 Q30 Q32 Q34 = IRF9310_0
Q3 Q4 Q8 Q9 Q12 Q13 Q16 Q17 Q20 Q21 Q24 Q25 Q28 Q29 Q31 Q33 Q35 = MOSFET N
Q7 Q36 = 2N2222: General Purpose Transistor NPN Silicon; Published: 29-Sep-2000; LatestRevisionDate: 17-Jul-2002; LatestRevisionNote: Re-released for DXP Platform.; DatasheetVersion: 1991; PackageVersion: 1997; PackageReference: 22-03; Publisher: Altium Limited; PackageDescription: Can; 3 Leads; Pin Circle Dia. 2.54 mm; Lead Dia. 0.48 mm (max); ComponentLink1Description: Manufacturer Link; ComponentLink1URL: http://www.onsemi.com/site/products/landing?taxonomyID=194
R1-R4 R7-R14 R16 R17 R20 R21 R24 R25 R27 R28 R34-R37 R40 R41 R43-R50 R480 = R_Dup4
R5 R6 R18 R22 R23 R26 R29-R33 R38 R52 R101 R200 R500 = Res1: Resistor; Published: 8-Jun-2000; LatestRevisionDate: 17-Jul-2002; LatestRevisionNote: Re-released for DXP Platform.; PackageReference: AXIAL-0.3; Publisher: Altium Limited
  R5 R18 R23 R33 R38 R101 R200 R500: PackageDescription: Axial Device, Thru-Hole; 2 Leads; 0.3 in Pin Spacing; Value: 1K
  R6: PackageDescription: Axial Device, Thru-Hole; 2 Leads; 0.3 in Pin Spacing; Value: 500
  R22: Value: 1k
  R26: PackageDescription: Axial Device, Thru-Hole; 2 Leads; 0.3 in Pin Spacing; Value: 1.5K
  R29-R32: PackageDescription: Axial Device, Thru-Hole; 2 Leads; 0.3 in Pin Spacing; Value: 100K
  R52: PackageDescription: Axial Device, Thru-Hole; 2 Leads; 0.3 in Pin Spacing; Value: 330
R15 R19 R51 = R
S1 = SW DIP-3: DIP Switch, 3 Position, SPST; Published: 24-Mar-1999; LatestRevisionDate: 17-Jul-2002; LatestRevisionNote: Re-released for DXP Platform.; PackageReference: DIP-6; Publisher: Altium Limited; Code_JEDEC: MO-001-AM
SW1 = Push-Button
U1 = AT91SAM7X256-AU: AT91 ARM Thumb-based 32-bit Microcontroller, 256KB Flash, 64KB SRAM, E-MAC, CAN, 100-Pin LQFP, Industrial Grade (-40°C to 85°C), Pb-Free; Published: 16-Oct-2006; DatasheetVersion: revH, Feb-2009; PackageVersion: Apr-2006; PackageReference: LQFP100; Publisher: Altium Limited; PackageDescription: 100-Pin Thin Quad Flat Pack 0.5 mm Pitch; Supplier 1: Digi-Key; Supplier Part Number 1: AT91SAM7X256-AU-ND; Supplier 2: Farnell; Supplier Part Number 2: 1288327; Supplier 3: Mouser; Supplier Part Number 3: 556-A91SAM7X256AU; Code_JEDEC: MS-026-BED; ComponentLink1Description: Manufacturer Link; ComponentLink1URL: http://www.atmel.com/products/AT91/default.asp?; ComponentLink2Description: AT91SAM7X Series Datasheet; ComponentLink2URL: http://www.atmel.com/dyn/resources/prod_documents/doc6120.pdf; ComponentLink3Description: AT91SAM7X Series Summary; ComponentLink3URL: http://www.atmel.com/dyn/resources/prod_documents/6120s.pdf; ComponentLink4Description: ARM7TDMI Reference Manual; ComponentLink4URL: http://www.atmel.com/dyn/resources/prod_documents/DDI0029G_7TDMI_R3_trm.pdf; ComponentLink5Description: Atmel.com Home; ComponentLink5URL: http://www.atmel.com
U2 = OP279GS: Rail-to-Rail High-Output-Current Operational Amplifier; Published: 8-Jun-2000; LatestRevisionDate: 13-Apr-2006; LatestRevisionNote: IPC-7351 Footprint Added.; DatasheetVersion: REV. D 1998; PackageVersion: revA; PackageReference: SO-8; Publisher: Altium Limited; PackageDescription: 8-Pin Small Outline Integrated Circuit 1.27 mm Pitch; Code_JEDEC: MS-012-AA; Code_IPC: SOIC127P600-8; ComponentLink1Description: Manufacturer Link; ComponentLink1URL: http://www.analog.com/en/prod/0,,759_786_OP279%2C00.html; ComponentLink2Description: Datasheet; ComponentLink2URL: http://www.analog.com/UploadedFiles/Data_Sheets/47069721OP179_279_g.pdf
U3-U5 = SN7404N: Hex Inverter; Published: 8-Jun-2000; LatestRevisionDate: 04-Mar-2005; LatestRevisionNote: Stylized 3D Model Added.; DatasheetVersion: Mar-1988; PackageVersion: Oct-1995; PackageReference: N014; Publisher: Altium Limited; PackageDescription: DIP; 14 Leads; Row Spacing 7.62 mm; Pitch 2.54 mm; ComponentLink1Description: Manufacturer Link; ComponentLink1URL: http://www.ti.com/; ComponentLink2Description: Datasheet; ComponentLink2URL: http://www-s.ti.com/sc/ds/sn5404.pdf; ComponentLink3Description: Packaging Specification; ComponentLink3URL: http://focus.ti.com/lit/ml/mpdi002c/mpdi002c.pdf
U6 = LM2576/TO_0
U7 = LT1086-12/TO
Y1 = XTAL: Crystal Oscillator; Published: 8-Jun-2000; LatestRevisionDate: 17-Jul-2002; LatestRevisionNote: Re-released for DXP Platform.; PackageReference: R38; Publisher: Altium Limited; PackageDescription: Crystal, Thru-Hole; 2 Leads; Body 3.1 x 8.2 mm (Dia.xH); Value: 18.432 MHZ